# EAGLE design Sens_BMP180 (EAGLE 6.3)
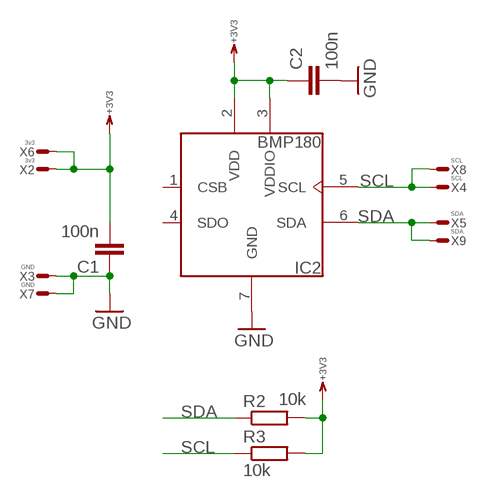
[diagram p0: schematic, sheet 1]

## Parts
C1  100n  C0603  [0603]
C2  100n  C0603  [0603]
IC2  BMP180  [7-VELGA]
R2  10k  R0603  [0603]
R3  10k  R0603  [0603]
X2  3v3  WIREPADT1.6/0.9  [T1.6/0.9]
X3  GND  WIREPADT1.6/0.9  [T1.6/0.9]
X4  SCL  WIREPADT1.6/0.9  [T1.6/0.9]
X5  SDA  WIREPADT1.6/0.9  [T1.6/0.9]
X6  3v3  WIREPADT1.6/0.9  [T1.6/0.9]
X7  GND  WIREPADT1.6/0.9  [T1.6/0.9]
X8  SCL  WIREPADT1.6/0.9  [T1.6/0.9]
X9  SDA  WIREPADT1.6/0.9  [T1.6/0.9]

## Nets
+3V3: C1.2 C2.1 IC2.2(VDD) IC2.3(VDDIO) R2.2 R3.2 X2.1(S) X6.1(S)
GND: C1.1 C2.2 IC2.7(GND) X3.1(S) X7.1(S)
SCL: IC2.5(SCL) R3.1 X4.1(S) X8.1(S)
SDA: IC2.6(SDA) R2.1 X5.1(S) X9.1(S)
Unconnected: IC2.1(CSB) IC2.4(SDO)

## Library data of the parts
C1 C2 = RCL:C: Capacitor SMD
IC2 = Sensors:BMP180
R2 R3 = RCL:R: Resistor SMD
X2-X9 = Conn:WIREPAD: Wire PAD connect wire on PCB

## Board
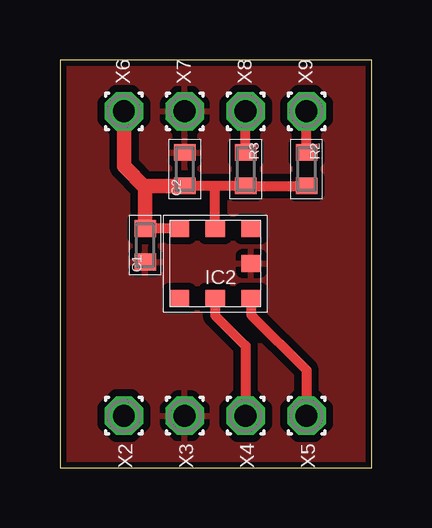
[diagram p1: board, top side]
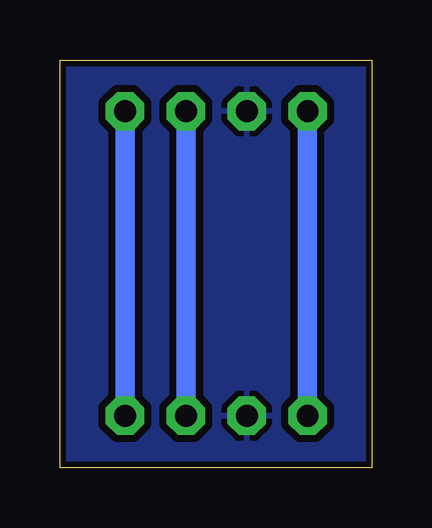
[diagram p2: board, bottom side, seen from below]

Size 13 x 17 mm. Coordinates in mm from the lower left corner, seen from the top.
Outline: 0,0 13,0 13,17 0,17 0,0
Copper layers (1*16): Top 0.035mm / dielectric 1.5mm / Bottom 0.035mm
Design rules "default": minimum track width 10mil, minimum drill 12mil, track to track 12mil, track to pad 12mil, pad to pad 12mil, via to via 12mil, smd to smd 12mil, copper to edge 10mil, drill to drill 8mil, minimum pad ring 10mil, minimum via ring 8mil, stop-mask expansion 4mil, vias tented up to drill 0mil, thermal gap 10mil

### Footprints (pad centres in the part's own frame; a part is rotated, then mirrored left to right if it is on the bottom)
0603 = smd 0.7 x 0.9: 1 -0.697,0; 2 0.697,0
7-VELGA = smd 0.8 x 0.7: 1 -1.5,-1.45; 2 0,-1.45; 3 1.5,-1.45; 4 1.5,1.45; 5 0,1.45; 6 -1.5,1.45; 7 -1.5,0
T1.6/0.9 = drill 0.914 pad 1.6 octagon: 1 0,0

### Placement (x,y rotation side)
C1  3.56,9.27 90 top
C2  5.21,12.45 90 top
IC2  6.48,8.51 180 top
R2  10.29,12.45 270 top
R3  7.75,12.45 270 top
X2  2.67,2.16 270 top
X3  5.21,2.16 270 top
X4  7.75,2.16 270 top
X5  10.29,2.16 270 top
X6  2.67,14.86 90 top
X7  5.21,14.86 90 top
X8  7.75,14.86 90 top
X9  10.29,14.86 90 top

### Tracks (layer width: path | path; a pad name or v marks a point on that pad's centre or on a via)
+3V3
  Top 0.406: 3.56,10.03 C1.2 | 3.62,11.75 3.56,11.68 | IC2.3 3.63,9.96 | R2.2 R3.2 6.48,11.75 | 6.48,11.75 C2.1 | IC2.2 6.48,11.75
  Top 0.61: X6.1 2.67,12.57 3.56,11.68 3.56,10.03 3.63,9.96 | C2.1 3.62,11.75
  Bottom 0.813: X2.1 X6.1
GND
  pour Top: 0,17 13,17 13,0 0,0
  pour Bottom: 0,0 13,0 13,17 0,17
SCL
  Top 0.406: R3.1 X8.1 | IC2.5 6.48,6.35 7.75,5.08 X4.1
  Bottom 0.813: X8.1 X4.1
SDA
  Top 0.406: R2.1 X9.1 | IC2.6 7.98,6.37 10.29,4.06 X5.1
  Bottom 0.813: X9.1 X5.1